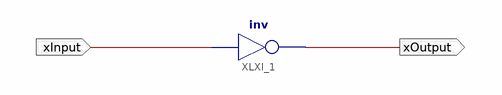
[diagram p0: schematic sheet 1]
// Xilinx ISE schematic asdf.sch (spartan6) as structural Verilog: 1 symbols, 2 ports
module asdf (
  input  xInput,
  output xOutput
);

  not XLXI_1 (xOutput, xInput);
endmodule
